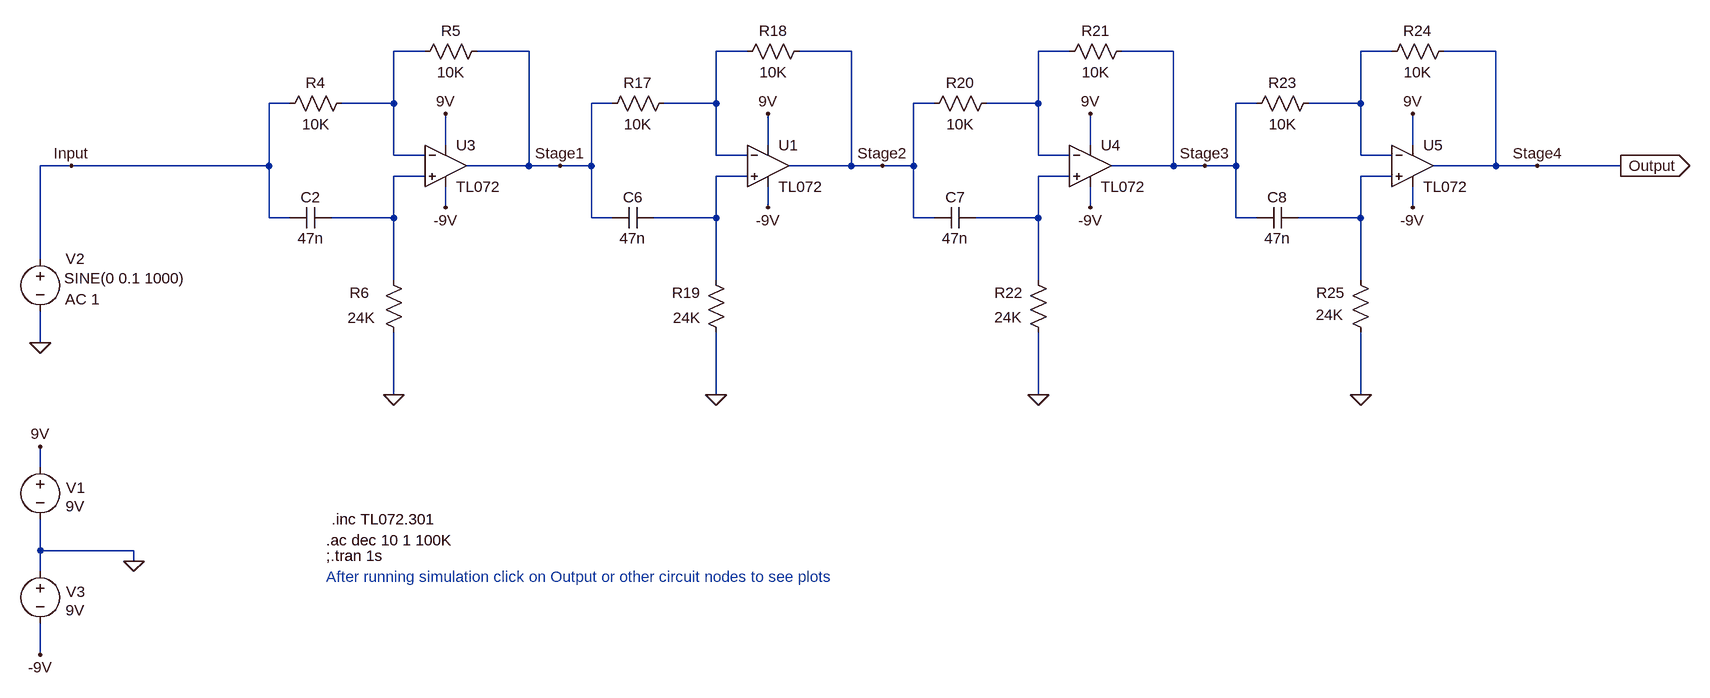
[diagram p0: schematic Phaser_eval.asc]
Phaser_eval.asc, the LTspice schematic file:
Version 4
SHEET 1 4292 1516
WIRE -1280 -64 -1328 -64
WIRE -1120 -64 -1200 -64
WIRE -784 -64 -832 -64
WIRE -624 -64 -704 -64
WIRE -288 -64 -336 -64
WIRE -128 -64 -208 -64
WIRE 208 -64 160 -64
WIRE 368 -64 288 -64
WIRE -1488 16 -1520 16
WIRE -1328 16 -1328 -64
WIRE -1328 16 -1408 16
WIRE -992 16 -1024 16
WIRE -832 16 -832 -64
WIRE -832 16 -912 16
WIRE -496 16 -528 16
WIRE -336 16 -336 -64
WIRE -336 16 -416 16
WIRE 0 16 -32 16
WIRE 160 16 160 -64
WIRE 160 16 80 16
WIRE -1248 80 -1248 32
WIRE -752 80 -752 32
WIRE -256 80 -256 32
WIRE 240 80 240 32
WIRE -1328 96 -1328 16
WIRE -1280 96 -1328 96
WIRE -832 96 -832 16
WIRE -784 96 -832 96
WIRE -336 96 -336 16
WIRE -288 96 -336 96
WIRE 160 96 160 16
WIRE 208 96 160 96
WIRE -1824 112 -1872 112
WIRE -1520 112 -1520 16
WIRE -1520 112 -1824 112
WIRE -1120 112 -1120 -64
WIRE -1120 112 -1216 112
WIRE -1072 112 -1120 112
WIRE -1024 112 -1024 16
WIRE -1024 112 -1072 112
WIRE -624 112 -624 -64
WIRE -624 112 -720 112
WIRE -576 112 -624 112
WIRE -528 112 -528 16
WIRE -528 112 -576 112
WIRE -128 112 -128 -64
WIRE -128 112 -224 112
WIRE -80 112 -128 112
WIRE -32 112 -32 16
WIRE -32 112 -80 112
WIRE 368 112 368 -64
WIRE 368 112 272 112
WIRE 432 112 368 112
WIRE 560 112 432 112
WIRE -1280 128 -1328 128
WIRE -784 128 -832 128
WIRE -288 128 -336 128
WIRE 208 128 160 128
WIRE -1248 176 -1248 144
WIRE -752 176 -752 144
WIRE -256 176 -256 144
WIRE 240 176 240 144
WIRE -1520 192 -1520 112
WIRE -1488 192 -1520 192
WIRE -1328 192 -1328 128
WIRE -1328 192 -1424 192
WIRE -1024 192 -1024 112
WIRE -992 192 -1024 192
WIRE -832 192 -832 128
WIRE -832 192 -928 192
WIRE -528 192 -528 112
WIRE -496 192 -528 192
WIRE -336 192 -336 128
WIRE -336 192 -432 192
WIRE -32 192 -32 112
WIRE 0 192 -32 192
WIRE 160 192 160 128
WIRE 160 192 64 192
WIRE -1872 256 -1872 112
WIRE -1328 288 -1328 192
WIRE -832 288 -832 192
WIRE -336 288 -336 192
WIRE 160 288 160 192
WIRE -1872 384 -1872 336
WIRE -1328 464 -1328 368
WIRE -832 464 -832 368
WIRE -336 464 -336 368
WIRE 160 464 160 368
WIRE -1872 576 -1872 544
WIRE -1872 704 -1872 656
WIRE -1728 704 -1872 704
WIRE -1728 720 -1728 704
WIRE -1872 736 -1872 704
WIRE -1872 864 -1872 816
FLAG -1728 720 0
FLAG -1872 544 9V
FLAG -1872 384 0
FLAG -1824 112 Input
FLAG -1248 32 9V
FLAG 560 112 Output
IOPIN 560 112 Out
FLAG -752 32 9V
FLAG -256 32 9V
FLAG 240 32 9V
FLAG 432 112 Stage4
FLAG -576 112 Stage2
FLAG -1072 112 Stage1
FLAG -80 112 Stage3
FLAG -1328 464 0
FLAG -832 464 0
FLAG -336 464 0
FLAG 160 464 0
FLAG -1872 864 -9V
FLAG -1248 176 -9V
FLAG -752 176 -9V
FLAG -256 176 -9V
FLAG 240 176 -9V
SYMBOL voltage -1872 560 R0
WINDOW 123 0 0 Left 0
WINDOW 39 0 0 Left 0
WINDOW 0 40 47 Left 2
WINDOW 3 39 76 Left 2
SYMATTR InstName V1
SYMATTR Value 9V
SYMBOL voltage -1872 240 R0
WINDOW 123 38 77 Left 2
WINDOW 39 24 44 Left 2
WINDOW 3 37 45 Left 2
WINDOW 0 39 15 Left 2
SYMATTR Value2 AC 1
SYMATTR Value SINE(0 0.1 1000)
SYMATTR InstName V2
SYMBOL opamp2 -1248 48 R0
WINDOW 0 16 32 Left 2
WINDOW 3 16 96 Left 2
SYMATTR InstName U3
SYMATTR Value TL072
SYMBOL res -1392 0 R90
WINDOW 0 0 56 VBottom 2
WINDOW 3 32 56 VTop 2
SYMATTR InstName R4
SYMATTR Value 10K
SYMBOL res -1184 -80 R90
WINDOW 0 0 56 VBottom 2
WINDOW 3 32 56 VTop 2
SYMATTR InstName R5
SYMATTR Value 10K
SYMBOL cap -1424 176 R90
WINDOW 0 0 32 VBottom 2
WINDOW 3 32 32 VTop 2
SYMATTR InstName C2
SYMATTR Value 47n
SYMBOL res -1344 272 R0
WINDOW 0 -52 35 Left 2
WINDOW 3 -55 74 Left 2
SYMATTR InstName R6
SYMATTR Value 24K
SYMBOL opamp2 -752 48 R0
WINDOW 0 16 32 Left 2
WINDOW 3 16 96 Left 2
SYMATTR InstName U1
SYMATTR Value TL072
SYMBOL res -896 0 R90
WINDOW 0 0 56 VBottom 2
WINDOW 3 32 56 VTop 2
SYMATTR InstName R17
SYMATTR Value 10K
SYMBOL res -688 -80 R90
WINDOW 0 0 56 VBottom 2
WINDOW 3 32 56 VTop 2
SYMATTR InstName R18
SYMATTR Value 10K
SYMBOL cap -928 176 R90
WINDOW 0 0 32 VBottom 2
WINDOW 3 32 32 VTop 2
SYMATTR InstName C6
SYMATTR Value 47n
SYMBOL res -848 272 R0
WINDOW 0 -52 35 Left 2
WINDOW 3 -50 74 Left 2
SYMATTR InstName R19
SYMATTR Value 24K
SYMBOL opamp2 -256 48 R0
WINDOW 0 16 32 Left 2
WINDOW 3 16 96 Left 2
SYMATTR InstName U4
SYMATTR Value TL072
SYMBOL res -400 0 R90
WINDOW 0 0 56 VBottom 2
WINDOW 3 32 56 VTop 2
SYMATTR InstName R20
SYMATTR Value 10K
SYMBOL res -192 -80 R90
WINDOW 0 0 56 VBottom 2
WINDOW 3 32 56 VTop 2
SYMATTR InstName R21
SYMATTR Value 10K
SYMBOL cap -432 176 R90
WINDOW 0 0 32 VBottom 2
WINDOW 3 32 32 VTop 2
SYMATTR InstName C7
SYMATTR Value 47n
SYMBOL res -352 272 R0
WINDOW 0 -52 35 Left 2
WINDOW 3 -52 73 Left 2
SYMATTR InstName R22
SYMATTR Value 24K
SYMBOL opamp2 240 48 R0
WINDOW 0 16 32 Left 2
WINDOW 3 16 96 Left 2
SYMATTR InstName U5
SYMATTR Value TL072
SYMBOL res 96 0 R90
WINDOW 0 0 56 VBottom 2
WINDOW 3 32 56 VTop 2
SYMATTR InstName R23
SYMATTR Value 10K
SYMBOL res 304 -80 R90
WINDOW 0 0 56 VBottom 2
WINDOW 3 32 56 VTop 2
SYMATTR InstName R24
SYMATTR Value 10K
SYMBOL cap 64 176 R90
WINDOW 0 0 32 VBottom 2
WINDOW 3 32 32 VTop 2
SYMATTR InstName C8
SYMATTR Value 47n
SYMBOL res 144 272 R0
WINDOW 0 -52 35 Left 2
WINDOW 3 -53 69 Left 2
SYMATTR InstName R25
SYMATTR Value 24K
SYMBOL voltage -1872 720 R0
WINDOW 123 0 0 Left 0
WINDOW 39 0 0 Left 0
WINDOW 0 40 47 Left 2
WINDOW 3 39 76 Left 2
SYMATTR InstName V3
SYMATTR Value 9V
TEXT -1424 656 Left 2 !.inc TL072.301
TEXT -1432 688 Left 2 !.ac dec 10 1 100K
TEXT -1432 712 Left 2 !;.tran 1s
TEXT -1432 744 Left 2 ;After running simulation click on Output or other circuit nodes to see plots

The netlist it stands for:
* Phaser_eval.asc
V1 9V 0 9V
V2 Input 0 SINE(0 0.1 1000) AC 1
XU3 N005 N001 9V -9V Stage1 TL072  ; pins In+ In- V+ V- OUT
R4 N001 Input 10K
R5 Stage1 N001 10K
C2 N005 Input 47n
R6 N005 0 24K
XU1 N006 N002 9V -9V Stage2 TL072  ; pins In+ In- V+ V- OUT
R17 N002 Stage1 10K
R18 Stage2 N002 10K
C6 N006 Stage1 47n
R19 N006 0 24K
XU4 N007 N003 9V -9V Stage3 TL072  ; pins In+ In- V+ V- OUT
R20 N003 Stage2 10K
R21 Stage3 N003 10K
C7 N007 Stage2 47n
R22 N007 0 24K
XU5 N008 N004 9V -9V Stage4 TL072  ; pins In+ In- V+ V- OUT
R23 N004 Stage3 10K
R24 Stage4 N004 10K
C8 N008 Stage3 47n
R25 N008 0 24K
V3 0 -9V 9V
.inc TL072.301
.ac dec 10 1 100K
;.tran 1s
* After running simulation click on Output or other circuit nodes to see plots
.backanno
.end